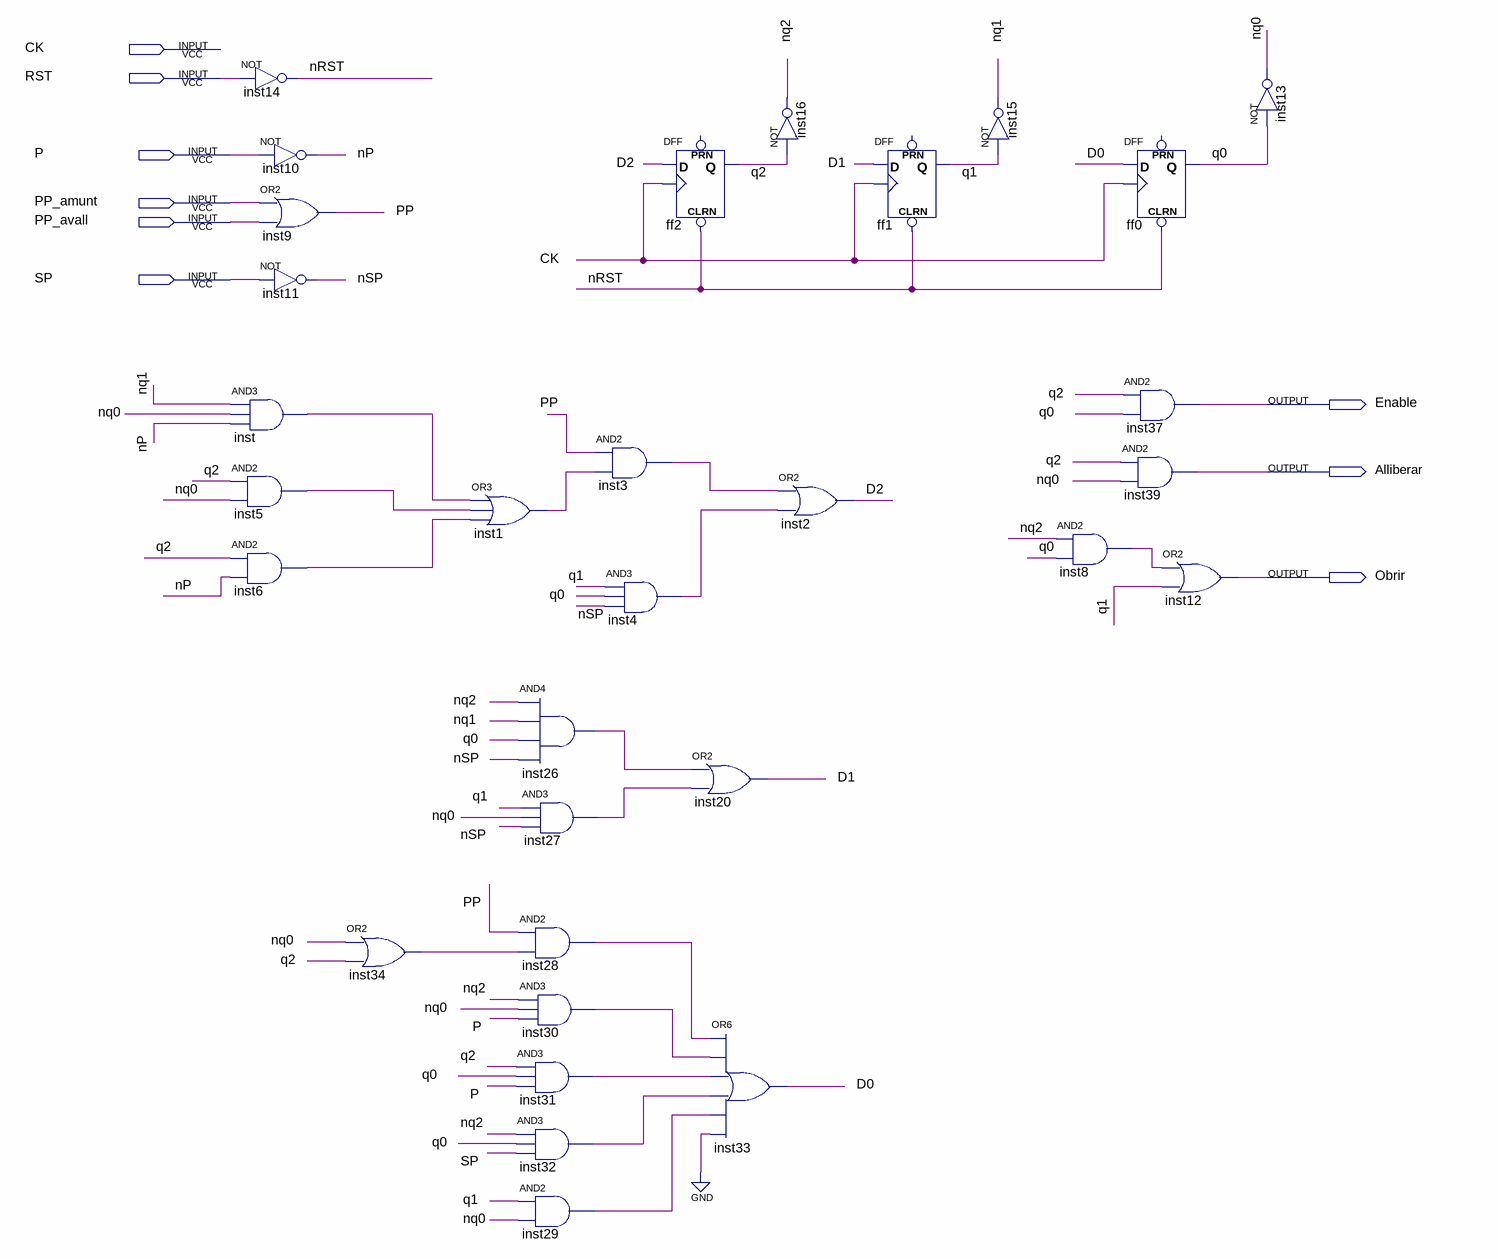
[diagram p0: schematic sheet]
// Quartus schematic UC_MOV.bdf as structural Verilog: 31 symbols, 9 pins
module UC_MOV (
  input  CK,
  input  RST,
  input  P,
  input  PP_amunt,
  input  PP_avall,
  input  SP,
  output Enable,
  output Alliberar,
  output Obrir
);

  wire D0, D1, D2, inst1_out, inst3_out, inst4_out, inst5_out, inst6_out, inst8_out, inst26_out, inst27_out,
       inst28_out, inst29_out, inst30_out, inst31_out, inst32_out, inst34_out, inst_out, nP, nq0, nq1, nq2,
       nRST, nSP, PP, q0, q1, q2;

  not inst14 (nRST, RST);
  and inst (inst_out, nq1, nq0, nP);
  and inst5 (inst5_out, q2, nq0);
  and inst6 (inst6_out, q2, nP);
  not inst10 (nP, P);
  or inst9 (PP, PP_amunt, PP_avall);
  not inst11 (nSP, SP);
  or inst34 (inst34_out, nq0, q2);
  or inst1 (inst1_out, inst_out, inst5_out, inst6_out);
  and inst26 (inst26_out, nq2, nq1, q0, nSP);
  and inst27 (inst27_out, q1, nq0, nSP);
  and inst28 (inst28_out, PP, inst34_out);
  and inst30 (inst30_out, nq2, nq0, P);
  and inst31 (inst31_out, q2, q0, P);
  and inst32 (inst32_out, nq2, q0, SP);
  and inst29 (inst29_out, q1, nq0);
  and inst3 (inst3_out, PP, inst1_out);
  and inst4 (inst4_out, q1, q0, nSP);
  DFF ff2 (.CLRN(nRST), .CLK(CK), .D(D2), .Q(q2));  // open: PRN
  or inst20 (D1, inst26_out, inst27_out);
  not inst16 (nq2, q2);
  or inst2 (D2, inst3_out, inst4_out);
  or inst33 (D0, inst28_out, inst30_out, inst31_out, inst32_out, inst29_out, 1'b0);
  DFF ff1 (.CLRN(nRST), .CLK(CK), .D(D1), .Q(q1));  // open: PRN
  not inst15 (nq1, q1);
  and inst8 (inst8_out, nq2, q0);
  DFF ff0 (.CLRN(nRST), .CLK(CK), .D(D0), .Q(q0));  // open: PRN
  and inst37 (Enable, q2, q0);
  and inst39 (Alliberar, q2, nq0);
  or inst12 (Obrir, inst8_out, q1);
  not inst13 (nq0, q0);
endmodule
